# EAGLE design laztech (EAGLE 7.5.0)
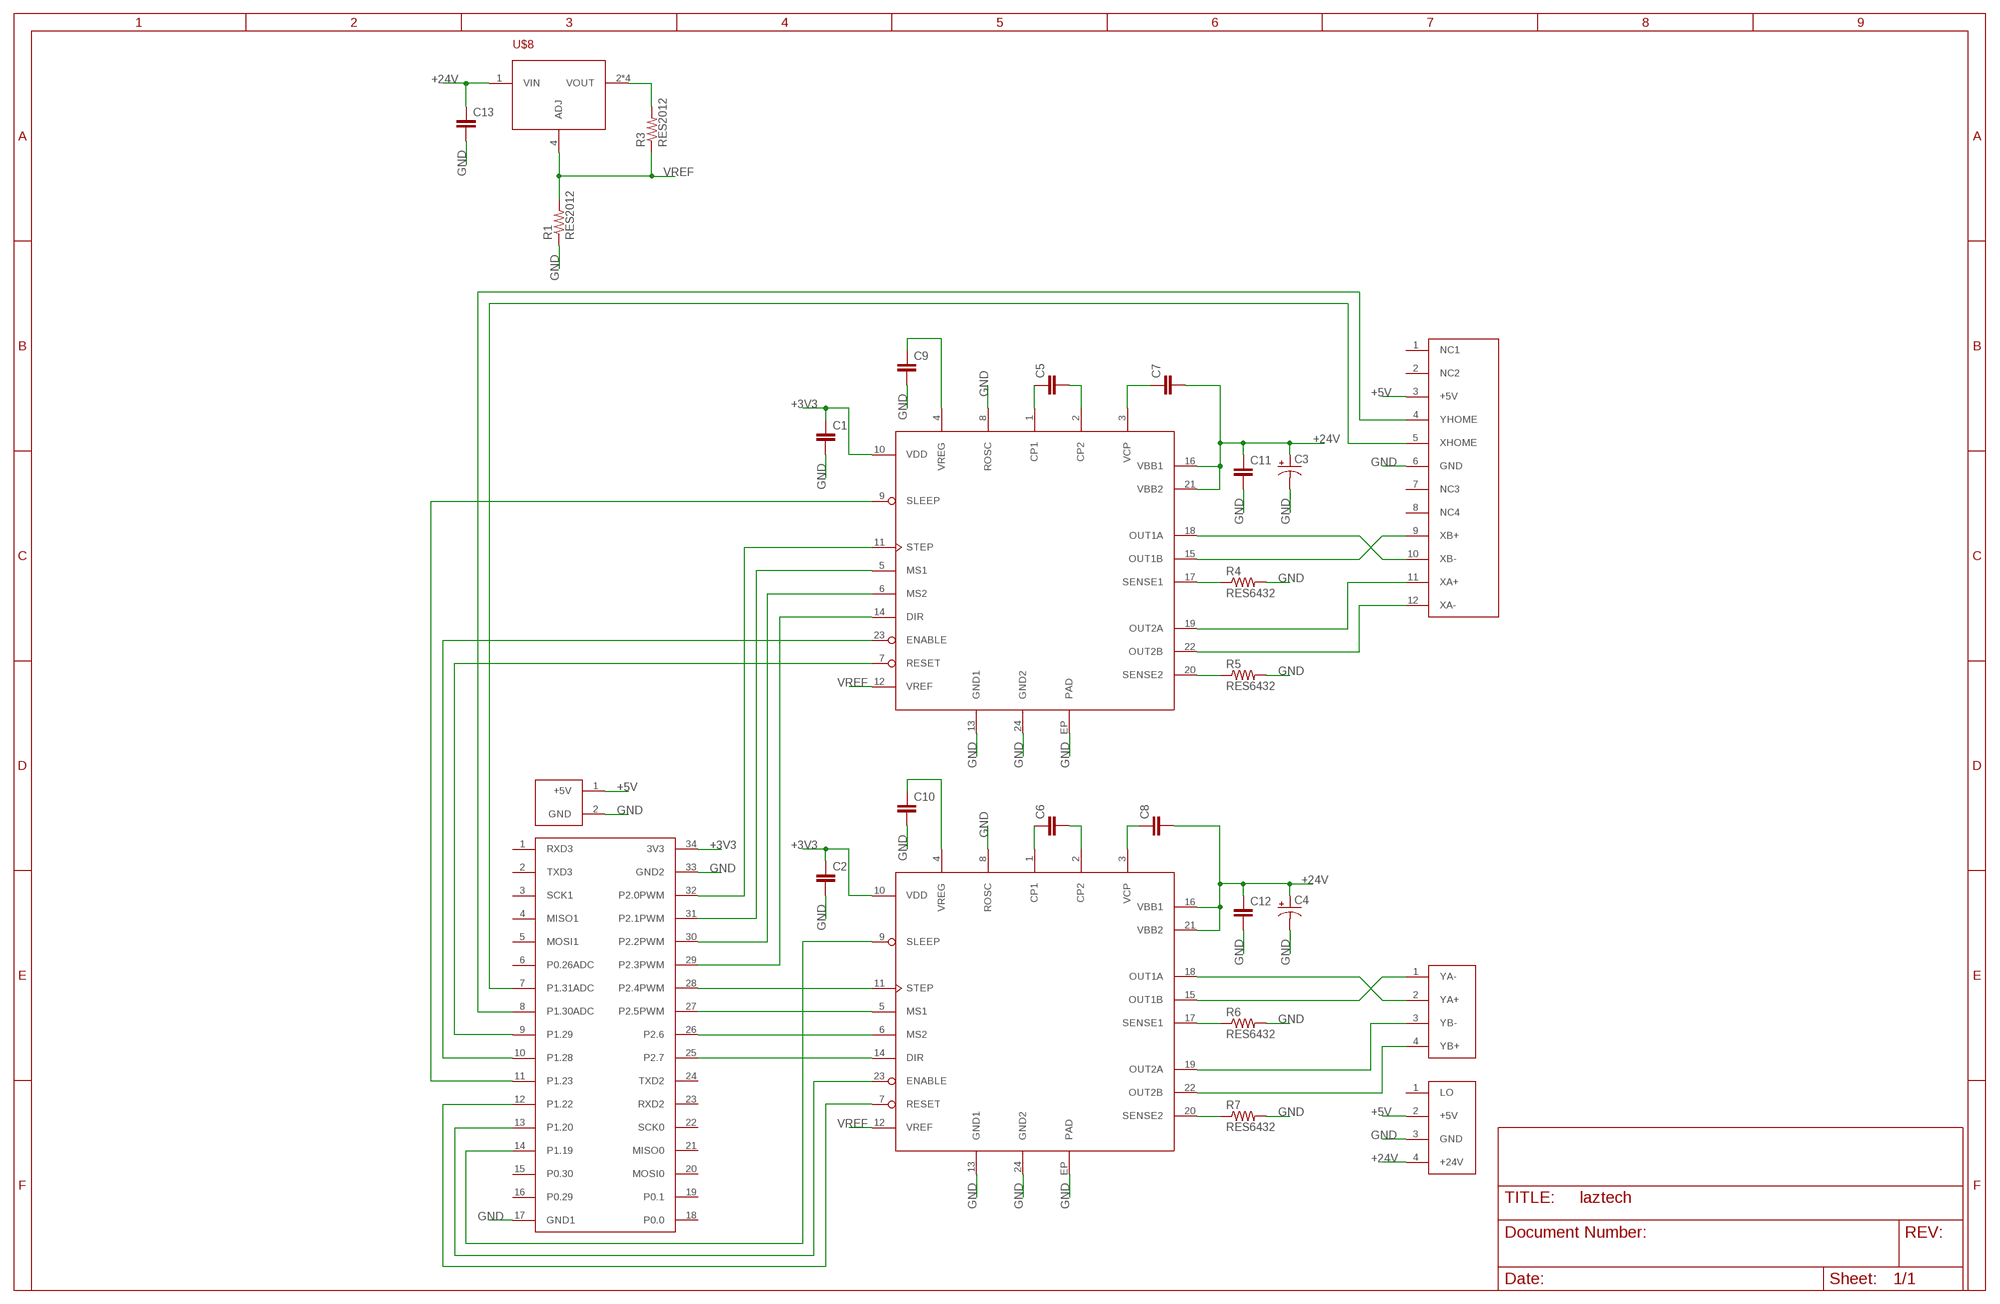
[diagram p0: schematic, sheet 1]

## Parts
C1  CAP  [C2012]
C2  CAP  [C2012]
C3  PCAP  [C6358R]
C4  PCAP  [C6358R]
C5  CAP  [C2012]
C6  CAP  [C2012]
C7  CAP  [C2012]
C8  CAP  [C2012]
C9  CAP  [C2012]
C10  CAP  [C2012]
C11  CAP  [C2012]
C12  CAP  [C2012]
C13  CAP  [C2012]
R1  RES2012  [R2012]
R3  RES2012  [R2012]
R4  RES6432  [R6432]
R5  RES6432  [R6432]
R6  RES6432  [R6432]
R7  RES6432  [R6432]
U$1  A4985SLPTR-T  [ETSSOP-24]
U$2  A4985SLPTR-T  [ETSSOP-24]
U$3  SJSUONEX  [2X17]
U$4  K40-PWR  [MOLEX-KK396-4-RA]
U$5  K40-X  [MOLEX-FFC-12-RA]
U$6  K40-Y  [JST-XH-4_RA]
U$7  SJSUONEVIN  [1X02]
U$8  LM317  [SOIC-8]

## Nets
+3V3: C1.1 C2.1 U$1.10(VDD) U$2.10(VDD) U$3.34(3V3)
+5V: U$4.2(+5V) U$5.3(+5V) U$7.1(+5V)
+24V: C3.2(+) C4.2(+) C7.2 C8.2 C11.1 C12.1 C13.1 U$1.16(VBB1) U$1.21(VBB2) U$2.16(VBB1) U$2.21(VBB2) U$4.4(+24V) U$8.1(VIN)
GND: C1.2 C2.2 C3.1(-) C4.1(-) C9.2 C10.2 C11.2 C12.2 C13.2 R1.1 R4.2 R5.2 R6.2 R7.2 U$1.8(ROSC) U$1.13(GND1) U$1.24(GND2) U$1.EP(PAD) U$2.8(ROSC) U$2.13(GND1) U$2.24(GND2) U$2.EP(PAD) U$3.17(GND1) U$3.33(GND2) U$4.3(GND) U$5.6(GND) U$7.2(GND)
N$1: U$1.18(OUT1A) U$5.10(XB-)
N$2: U$1.15(OUT1B) U$5.9(XB+)
N$3: U$1.19(OUT2A) U$5.11(XA+)
N$4: U$1.22(OUT2B) U$5.12(XA-)
N$5: U$2.15(OUT1B) U$6.1(YA-)
N$6: U$2.18(OUT1A) U$6.2(YA+)
N$7: U$2.19(OUT2A) U$6.3(YB-)
N$8: U$2.22(OUT2B) U$6.4(YB+)
N$9: R4.1 U$1.17(SENSE1)
N$10: U$3.7(P1.31ADC) U$5.5(XHOME)
N$11: U$3.8(P1.30ADC) U$5.4(YHOME)
N$12: U$2.14(DIR) U$3.25(P2.7)
N$13: U$2.6(MS2) U$3.26(P2.6)
N$14: U$2.5(MS1) U$3.27(P2.5PWM)
N$15: U$2.11(STEP) U$3.28(P2.4PWM)
N$16: U$1.11(STEP) U$3.32(P2.0PWM)
N$17: U$1.5(MS1) U$3.31(P2.1PWM)
N$18: U$1.6(MS2) U$3.30(P2.2PWM)
N$19: U$1.14(DIR) U$3.29(P2.3PWM)
N$20: U$2.23(ENABLE) U$3.13(P1.20)
N$21: U$2.7(RESET) U$3.12(P1.22)
N$22: U$2.9(SLEEP) U$3.14(P1.19)
N$23: U$1.7(RESET) U$3.9(P1.29)
N$24: U$1.23(ENABLE) U$3.10(P1.28)
N$25: U$1.9(SLEEP) U$3.11(P1.23)
N$26: C10.1 U$2.4(VREG)
N$27: C6.1 U$2.1(CP1)
N$28: C6.2 U$2.2(CP2)
N$29: C8.1 U$2.3(VCP)
N$30: C9.1 U$1.4(VREG)
N$31: C5.1 U$1.1(CP1)
N$32: C5.2 U$1.2(CP2)
N$33: C7.1 U$1.3(VCP)
N$34: R3.2 U$8.2(VOUT) U$8.3(VOUT) U$8.6(VOUT) U$8.7(VOUT)
N$35: R5.1 U$1.20(SENSE2)
N$38: R6.1 U$2.17(SENSE1)
N$40: R7.1 U$2.20(SENSE2)
VREF: R1.2 R3.1 U$1.12(VREF) U$2.12(VREF) U$8.4(ADJ)
Unconnected: U$3.1(RXD3) U$3.2(TXD3) U$3.3(SCK1) U$3.4(MISO1) U$3.5(MOSI1) U$3.6(P0.26ADC) U$3.15(P0.30) U$3.16(P0.29) U$3.18(P0.0) U$3.19(P0.1) U$3.20(MOSI0) U$3.21(MISO0) U$3.22(SCK0) U$3.23(RXD2) U$3.24(TXD2) U$4.1(LO) U$5.1(NC1) U$5.2(NC2) U$5.7(NC3) U$5.8(NC4)

## Library data of the parts
C1 C2 C5-C13 = laztech_parts:CAP
C3 C4 = laztech_parts:PCAP
R1 R3-R7 = laztech_parts:RES
U$1 U$2 = laztech_parts:A4985SLPTR-T
U$3 = laztech_parts:SJSUONEX
U$4 = laztech_parts:K40-PWR
U$5 = laztech_parts:K40-X
U$6 = laztech_parts:K40-Y
U$7 = laztech_parts:SJSUONEVIN
U$8 = laztech_parts:LM317

## Board
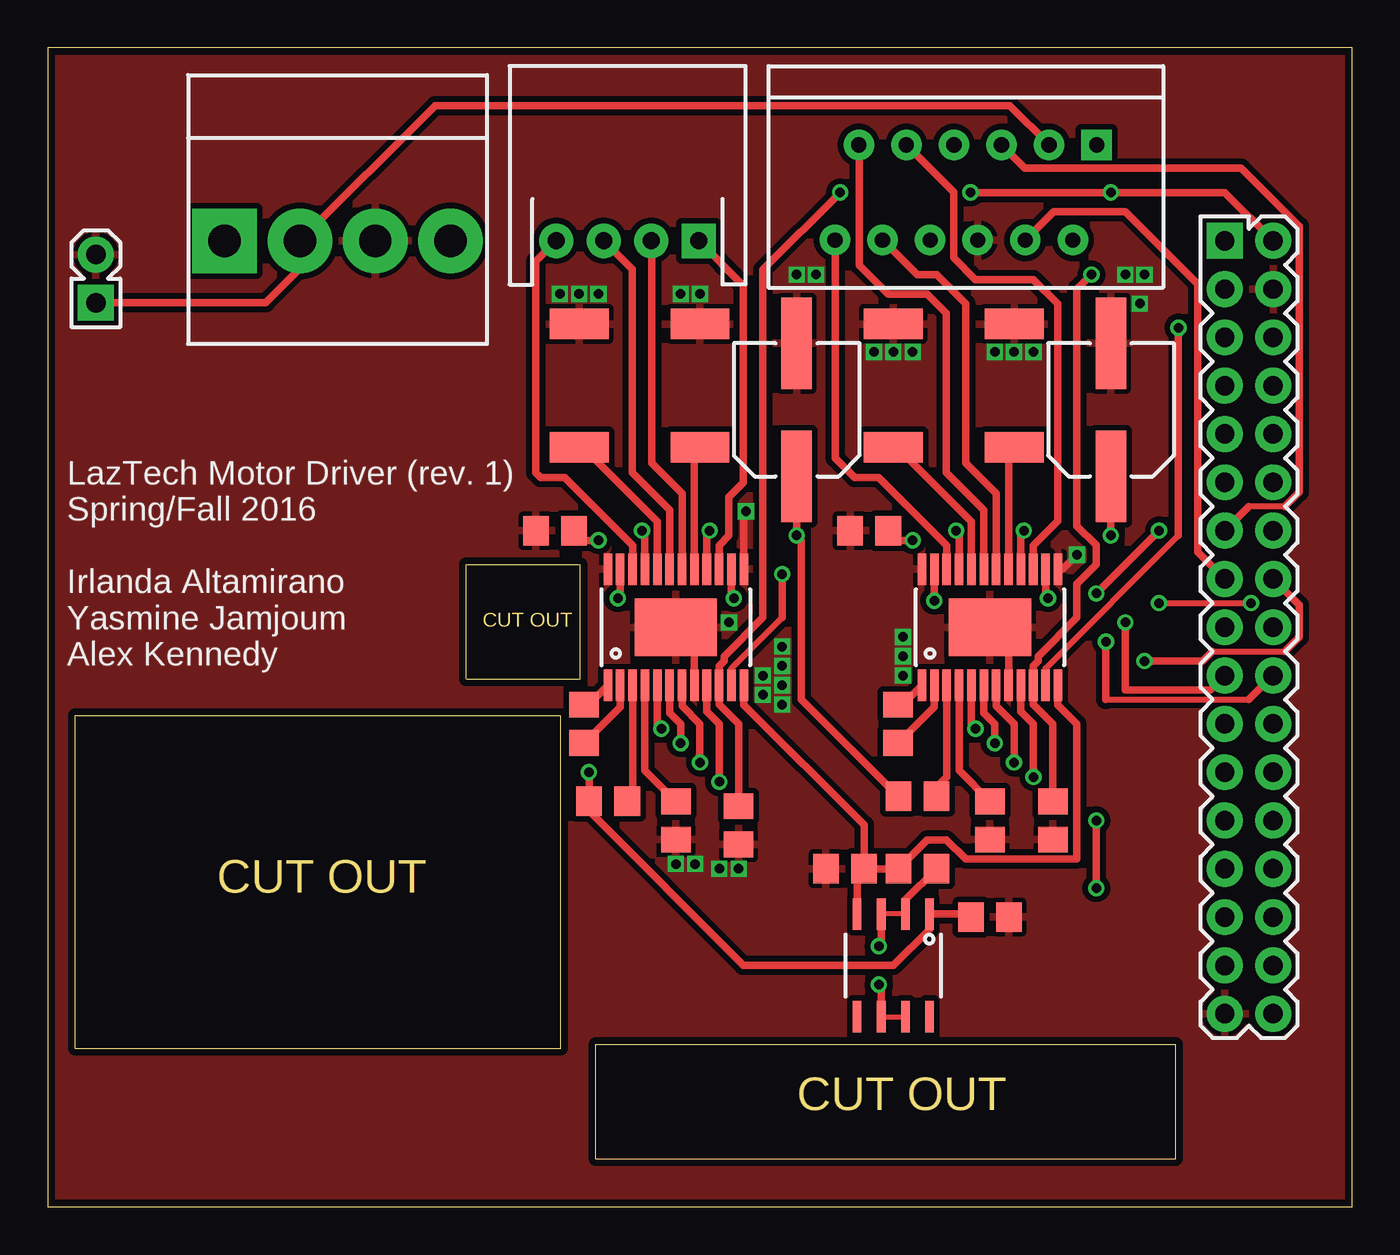
[diagram p1: board, top side]
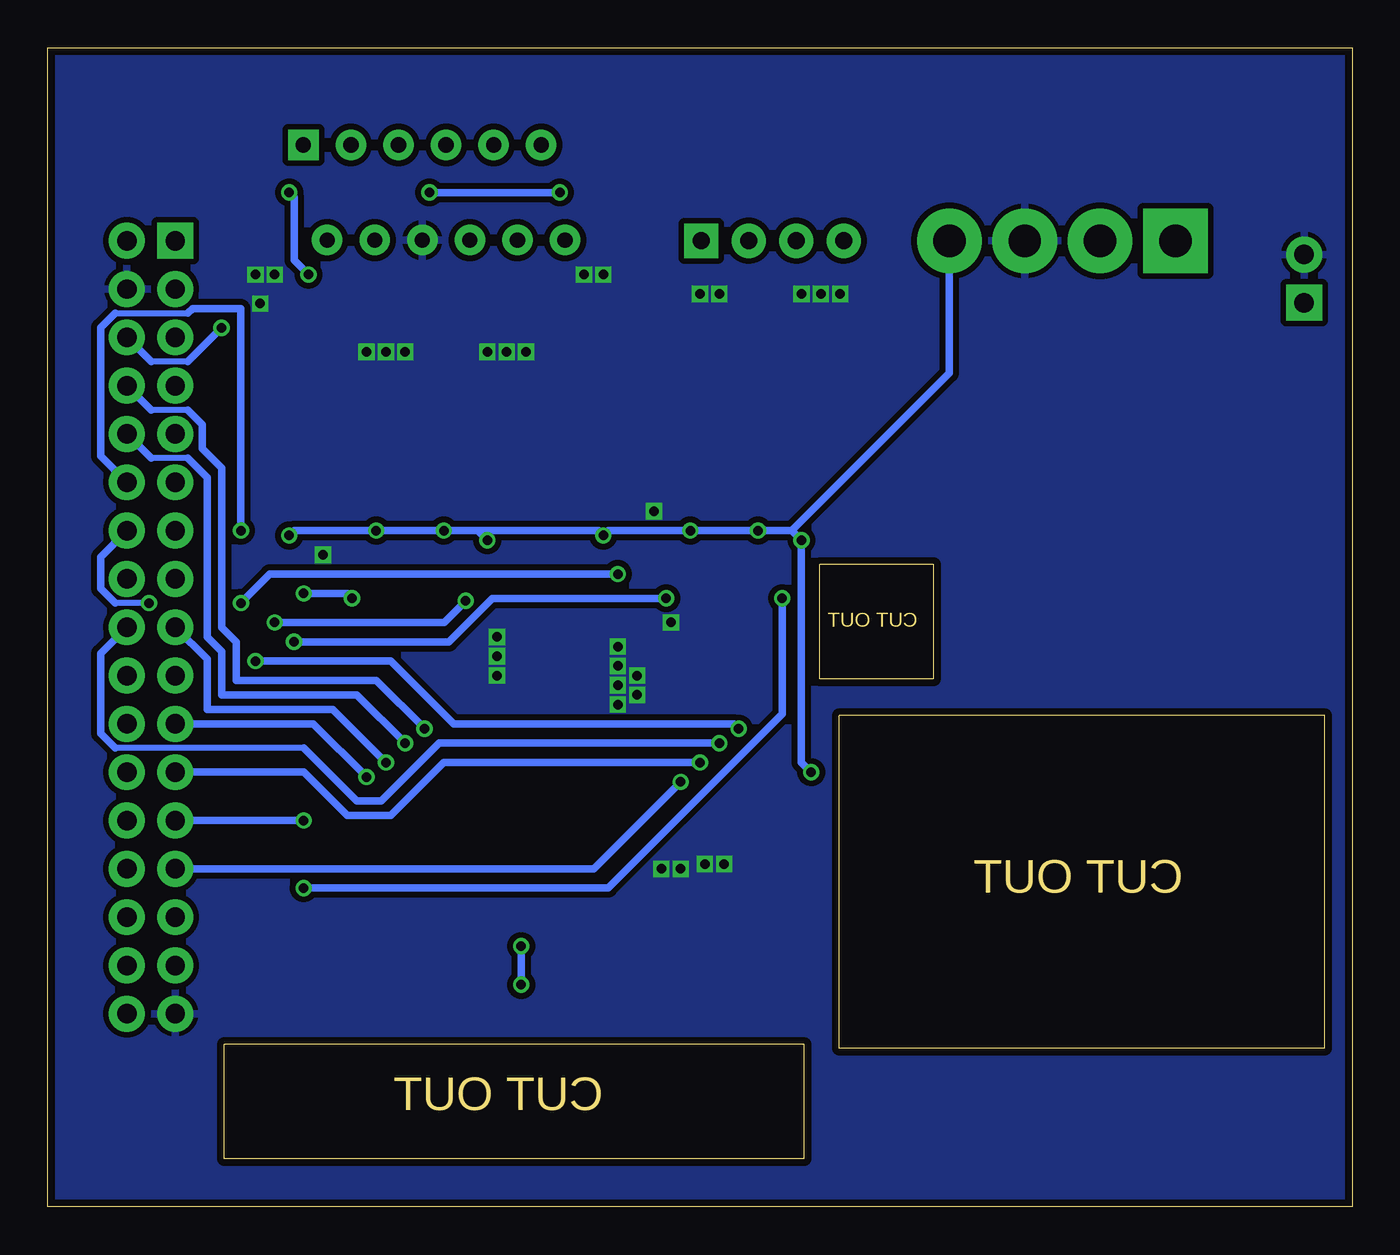
[diagram p2: board, bottom side, seen from below]

Size 68.58 x 60.96 mm. Coordinates in mm from the lower left corner, seen from the top.
Outline: 0,0 68.58,0 68.58,60.96 0,60.96 0,0
Outline: 22,27.77 22,33.77 28,33.77 28,27.77 22,27.77
Outline: 1.46,8.34 1.46,25.84 26.96,25.84 26.96,8.34 1.46,8.34
Outline: 28.8,2.54 28.8,8.54 59.3,8.54 59.3,2.54 28.8,2.54
Copper layers (1*16): Top 0.0356mm / dielectric 1.5011mm / Bottom 0.0356mm
Design rules "LaenPCBOrder": minimum track width 6mil, minimum drill 13mil, track to track 6mil, track to pad 6mil, pad to pad 6mil, via to via 6mil, smd to smd 6mil, copper to edge 15mil, drill to drill 6mil, minimum pad ring 7mil, minimum via ring 7mil, stop-mask expansion 3mil, vias tented up to drill 0mil, thermal gap 10mil

### Footprints (pad centres in the part's own frame; a part is rotated, then mirrored left to right if it is on the bottom)
C2012 = smd 1.35 x 1.55: 1 -1,0; 2 1,0
C6358R = smd 4.8 x 1.6: 1 -3.5,0; 2 3.5,0
R2012 = smd 1.35 x 1.55: 1 -1,0; 2 1,0
R6432 = smd 1.6 x 3.1: 1 -3.25,0; 2 3.25,0
ETSSOP-24 = smd 0.45 x 1.65: 1 -3.575,-3.05; 2 -2.925,-3.05; 3 -2.275,-3.05; 4 -1.625,-3.05; 5 -0.975,-3.05; 6 -0.325,-3.05; 7 0.325,-3.05; 8 0.975,-3.05; 9 1.625,-3.05; 10 2.275,-3.05; 11 2.925,-3.05; 12 3.575,-3.05; 13 3.575,3.05; 14 2.925,3.05; 15 2.275,3.05; 16 1.625,3.05; 17 0.975,3.05; 18 0.325,3.05; 19 -0.325,3.05; 20 -0.975,3.05; 21 -1.625,3.05; 22 -2.275,3.05; 23 -2.925,3.05; 24 -3.575,3.05 | smd 4.32 x 3: EP 0,0
2X17 = drill 1.02 pad 1.887 square: 1 -20.32,-1.27 | drill 1.02 pad 1.887: 2 -17.78,-1.27; 3 -15.24,-1.27; 4 -12.7,-1.27; 5 -10.16,-1.27; 6 -7.62,-1.27; 7 -5.08,-1.27; 8 -2.54,-1.27; 9 0,-1.27; 10 2.54,-1.27; 11 5.08,-1.27; 12 7.62,-1.27; 13 10.16,-1.27; 14 12.7,-1.27; 15 15.24,-1.27; 16 17.78,-1.27; 17 20.32,-1.27; 18 20.32,1.27; 19 17.78,1.27; 20 15.24,1.27; 21 12.7,1.27; 22 10.16,1.27; 23 7.62,1.27; 24 5.08,1.27; 25 2.54,1.27; 26 0,1.27; 27 -2.54,1.27; 28 -5.08,1.27; 29 -7.62,1.27; 30 -10.16,1.27; 31 -12.7,1.27; 32 -15.24,1.27; 33 -17.78,1.27; 34 -20.32,1.27
MOLEX-KK396-4-RA = drill 1.7 pad 3.4 square: 1 -5.94,0 | drill 1.7 pad 3.4: 2 -1.98,0; 3 1.98,0; 4 5.94,0
MOLEX-FFC-12-RA = drill 0.8 pad 1.6 square: 1 6.875,2.5 | drill 0.8 pad 1.6: 2 5.625,-2.5; 3 4.375,2.5; 4 3.125,-2.5; 5 1.875,2.5; 6 0.625,-2.5; 7 -0.625,2.5; 8 -1.875,-2.5; 9 -3.125,2.5; 10 -4.375,-2.5; 11 -5.625,2.5; 12 -6.875,-2.5
JST-XH-4_RA = drill 0.9 pad 1.8 square: 1 3.75,0 | drill 0.9 pad 1.8: 2 1.25,0; 3 -1.25,0; 4 -3.75,0
1X02 = drill 1.02 pad 1.887 square: 1 -1.27,0 | drill 1.02 pad 1.887: 2 1.27,0
SOIC-8 = smd 0.45 x 1.65: 1 -1.905,-2.7; 2 -0.635,-2.7; 3 0.635,-2.7; 4 1.905,-2.7; 5 1.905,2.7; 6 0.635,2.7; 7 -0.635,2.7; 8 -1.905,2.7

### Placement (x,y rotation side)
C1  52.83,20.32 270 top
C2  36.32,20.07 270 top
C3  55.88,41.91 270 top
C4  39.37,41.91 270 top
C5  44.7,25.4 270 top
C6  28.19,25.4 270 top
C7  45.72,21.59 180 top
C8  29.46,21.34 180 top
C9  49.53,20.32 270 top
C10  33.02,20.32 270 top
C11  43.18,35.56 180 top
C12  26.67,35.56 180 top
C13  49.53,15.24 0 top
R1  41.91,17.78 0 top
R3  45.72,17.78 0 top
R4  50.8,43.18 90 top
R5  44.45,43.18 90 top
R6  34.29,43.18 90 top
R7  27.94,43.18 90 top
U$1  49.53,30.48 0 top
U$2  33.02,30.48 0 top
U$3  63.14,30.48 270 top
U$4  15.24,50.8 0 top
U$5  48.26,53.34 0 top
U$6  30.48,50.8 0 top
U$7  2.54,48.81 90 top
U$8  44.45,12.7 180 top

### Tracks (layer width: path | path; a pad name or v marks a point on that pad's centre or on a via)
+3V3  (via drill 0.5 pad 0.25)
  Top 0.406: U$2.10 35.3,26.43 35.31,26.42 | C2.1 36.32,25.4 35.31,26.42 | C1.1 52.83,25.4 51.8,26.43 U$1.10 51.8,28.44 52.07,28.7 52.07,28.96 54.1,30.99 54.1,32.77 55.12,33.78 55.12,34.8 54.1,35.81 54.1,48.26 v54.86,49.02 | 35.31,26.42 35.31,28.45 35.56,28.7 35.56,28.96 37.59,30.99 37.59,49.28 v41.66,53.34 | v48.51,53.34 v55.88,53.34 61.87,53.34 U$3.34
  Bottom 0.406: v41.66,53.34 v48.51,53.34 | v54.86,49.02 55.63,49.78 55.63,53.09 v55.88,53.34
+5V
  Top 0.406: U$5.3 50.56,57.91 20.37,57.91 U$4.2 13.26,49.33 11.47,47.54 U$7.1
+24V  (via drill 0.5 pad 0.25)
  Top 0.406: U$2.21 31.39,35.41 v31.24,35.56 | v28.96,35.05 28.18,35.05 C12.1 | U$1.21 47.91,35.41 v47.75,35.56 | v45.47,35.05 44.69,35.05 C11.1 | C4.2 v39.37,35.31 39.62,35.05 39.62,26.69 C7.2 | C3.2 v55.88,35.31 | U$2.16 34.65,35.41 v34.8,35.56 | U$1.16 51.16,35.41 v51.31,35.56 | C13.1 48.37,15.4 U$8.1 46.35,14.61 44.45,12.7 36.58,12.7 28.46,20.81 C8.2 28.46,22.88 v28.45,22.86
  Bottom 0.406: 29.46,35.56 v31.24,35.56 v34.8,35.56 39.12,35.56 v39.37,35.31 39.62,35.56 45.97,35.56 | 29.46,35.56 v28.96,35.05 28.96,23.37 v28.45,22.86 | 45.97,35.56 v47.75,35.56 v51.31,35.56 55.63,35.56 v55.88,35.31 | 45.97,35.56 v45.47,35.05 | U$4.4 21.18,43.84 29.46,35.56
GND  (via drill 0.5)
  Top 0.254: 33.99,29.5 U$2.EP | 50.51,29.5 U$1.EP
  Top 0.406: U$2.8 33.99,29.5 | U$1.8 50.51,29.5 | U$1.13 53.34,33.53 v54.1,34.29 | U$2.13 36.59,36.34 v36.7,36.58
  other vias: 27.94,48.01 28.96,48.01 26.92,48.01 34.29,48.01 33.27,48.01 44.45,44.96 45.47,44.96 43.43,44.96 50.8,44.96 49.78,44.96 51.82,44.96 39.37,49.02 40.39,49.02 56.64,49.02 57.66,49.02 57.4,47.5 35.81,30.73 38.61,26.42 38.61,27.43 38.61,28.45 38.61,29.46 37.59,26.92 37.59,27.94 36.32,17.78 35.31,17.78 33.02,18.03 34.04,18.03 44.96,27.94 44.96,28.96 44.96,29.97
  pour Bottom (isolate 0.305): -1.27,-1.27 -1.27,62.23 69.85,62.23 69.85,-1.27
  pour Top (isolate 0.305): -2.54,-2.54 -2.54,63.5 71.12,63.5 71.12,-2.54
N$1
  Top 0.406: U$1.18 49.85,37.52 48.26,39.12 48.26,47.5 46.74,49.02 45.7,49.02 U$5.10
N$2
  Top 0.406: U$1.15 51.8,34.79 53.09,36.07 53.09,47.5 51.82,48.77 48.77,48.77 47.62,49.91 47.62,53.35 U$5.9
N$3
  Top 0.406: U$1.19 49.2,36.65 47.24,38.61 47.24,46.99 46.23,48.01 44.2,48.01 42.67,49.53 42.67,55.8 U$5.11
N$4
  Top 0.406: U$1.22 47.26,34.79 43.69,38.35 42.42,38.35 41.4,39.37 41.4,50.82 U$5.12
N$5
  Top 0.406: U$2.15 35.3,34.79 35.81,35.31 35.81,37.34 36.58,38.1 36.58,48.45 U$6.1
N$6
  Top 0.406: U$2.18 33.34,37.52 31.75,39.12 31.75,50.78 U$6.2
N$7
  Top 0.406: U$2.19 32.7,36.65 30.73,38.61 30.73,49.3 U$6.3
N$8
  Top 0.406: U$2.22 30.75,34.79 27.18,38.35 25.91,38.35 25.65,38.61 25.65,49.72 U$6.4
N$9
  Top 0.406: U$1.17 50.51,39.63 R4.1
N$10
  Top 0.305: 65.02,36.83 63.14,36.83
  Top 0.406: U$5.5 51.37,54.61 62.74,54.61 65.79,51.56 65.79,37.59 65.02,36.83 | 63.14,36.83 U$3.7
N$11
  Top 0.406: U$3.8 60.45,34.44 60.45,48.51 56.64,52.32 52.87,52.32 U$5.4
N$12  (via drill 0.5 pad 0.25)
  Top 0.305: 55.63,26.67 63.14,26.67
  Top 0.406: U$2.14 35.95,32.13 v36.07,32 | v55.63,29.72 55.63,26.67 | 63.14,26.67 U$3.25
  Bottom 0.406: v36.07,32 45.21,32 47.5,29.72 v55.63,29.72
N$13  (via drill 0.5 pad 0.25)
  Top 0.406: U$2.6 32.7,25.98 33.27,25.4 v33.27,24.38
  Bottom 0.305: 55.12,24.13 65.02,24.13
  Bottom 0.406: v33.27,24.38 48.01,24.38 51.05,21.34 52.32,21.34 55.12,24.13 | 65.02,24.13 65.79,24.89 65.79,29.1 U$3.26
N$14  (via drill 0.5 pad 0.25)
  Top 0.305: 61.21,29.21 65.02,29.21
  Top 0.406: U$2.5 32.05,25.36 v32.26,25.15 | 61.21,29.21 60.71,28.7 v57.66,28.7 | 65.02,29.21 65.79,29.97 65.79,31.64 U$3.27
  Bottom 0.406: v32.26,25.15 32.51,25.4 47.24,25.4 50.55,28.7 v57.66,28.7
N$15  (via drill 0.5 pad 0.25)
  Top 0.305: U$2.11 35.95,28.32 38.61,30.99 | v58.42,31.75 v63.25,31.75
  Top 0.406: 38.61,30.99 v38.61,33.27
  Bottom 0.305: v63.25,31.75 65.02,31.75
  Bottom 0.406: v38.61,33.27 56.9,33.27 v58.42,31.75 | 65.02,31.75 65.79,32.51 65.79,34.18 U$3.28
N$16  (via drill 0.5 pad 0.25)
  Top 0.305: U$1.11 52.45,28.32 59.44,35.31
  Top 0.406: 59.44,35.31 v59.44,46.23
  Bottom 0.305: 61.21,44.45 63.14,44.45
  Bottom 0.406: v59.44,46.23 61.21,44.45 | 63.14,44.45 U$3.32
N$17  (via drill 0.5 pad 0.25)
  Top 0.406: U$1.5 48.55,25.36 v48.77,25.15
  Bottom 0.305: 61.21,41.91 63.14,41.91
  Bottom 0.406: v48.77,25.15 51.31,27.69 58.67,27.69 58.67,29.72 59.44,30.48 59.44,38.86 60.45,39.88 60.45,41.15 61.21,41.91 | 63.14,41.91 U$3.31
N$18  (via drill 0.5 pad 0.25)
  Top 0.406: U$1.6 49.2,25.98 49.78,25.4 v49.78,24.38
  Bottom 0.305: 61.21,39.37 63.14,39.37
  Bottom 0.406: v49.78,24.38 52.32,26.92 59.44,26.92 59.44,29.21 60.2,29.97 60.2,38.35 61.21,39.37 | 63.14,39.37 U$3.30
N$19  (via drill 0.5 pad 0.25)
  Top 0.406: v58.42,35.56 v55.12,32.26 | v52.58,32 52.45,32.13 U$1.14
  Bottom 0.305: 65.02,46.99 61.21,46.99
  Bottom 0.406: U$3.29 65.79,39.48 65.79,46.23 65.02,46.99 | 61.21,46.99 60.96,47.24 58.42,47.24 v58.42,35.56 | v55.12,32.26 52.83,32.26 v52.58,32
N$20  (via drill 0.5 pad 0.25)
  Top 0.406: v55.12,20.32 v55.12,16.76 | v29.97,32 30.09,32.13 U$2.23
  Bottom 0.406: U$3.13 v55.12,20.32 | v55.12,16.76 39.12,16.76 29.97,25.91 v29.97,32
N$21  (via drill 0.5 pad 0.25)
  Top 0.406: U$2.7 33.34,26.34 34.29,25.4 v34.29,23.37
  Bottom 0.406: v34.29,23.37 47.75,23.37 50.55,20.57 52.83,20.57 55.12,22.86 U$3.12
N$22  (via drill 0.5 pad 0.25)
  Top 0.406: U$2.9 34.65,26.06 35.31,25.4 v35.31,22.35
  Bottom 0.406: v35.31,22.35 39.88,17.78 U$3.14
N$23  (via drill 0.5 pad 0.25)
  Top 0.406: U$1.7 49.85,26.34 50.8,25.4 v50.8,23.37
  Bottom 0.406: v50.8,23.37 53.59,26.16 60.2,26.16 60.2,28.81 U$3.9
N$24  (via drill 0.5 pad 0.25)
  Top 0.406: U$1.23 v46.6,31.87 | v56.64,30.73 56.64,27.18 61.11,27.18 U$3.10
  Bottom 0.406: v46.6,31.87 47.74,30.73 v56.64,30.73
N$25  (via drill 0.5 pad 0.25)
  Top 0.406: U$1.9 51.16,26.06 51.82,25.4 v51.82,22.61
  Bottom 0.406: v51.82,22.61 54.61,25.4 U$3.11
N$26
  Top 0.406: U$2.4 31.39,22.95 C10.1
N$27
  Top 0.406: U$2.1 28.41,26.4 C6.1
N$28
  Top 0.406: U$2.2 30.09,26.3 C6.2
N$29
  Top 0.406: U$2.3 30.75,21.6 30.46,21.32 C8.1
N$30
  Top 0.406: U$1.4 47.91,22.95 C9.1
N$31
  Top 0.406: U$1.1 44.92,26.4 C5.1
N$32
  Top 0.406: U$1.2 46.6,26.3 C5.2
N$33
  Top 0.406: U$1.3 47.26,22.62 46.72,22.08 C7.1
N$34  (via drill 0.5 pad 0.25)
  Top 0.254: U$8.2 U$8.3 | U$8.6 U$8.7
  Top 0.406: R3.2 45.09,16.14 U$8.2 | U$8.6 43.81,11.68 v43.69,11.68 | v43.69,13.72 43.81,13.72 U$8.3
  Bottom 0.406: v43.69,11.68 v43.69,13.72
N$35
  Top 0.406: U$1.20 48.55,36.03 44.65,39.93 R5.1
N$38
  Top 0.406: U$2.17 33.99,39.63 R6.1
N$40
  Top 0.406: U$2.20 32.05,36.03 28.14,39.93 R7.1
VREF
  Top 0.406: U$8.4 42.55,17.41 R1.2 | R1.2 R3.1 46.24,19.3 47.24,19.3 48.26,18.29 54.1,18.29 54.1,25.4 53.1,26.4 U$1.12 | U$2.12 36.59,26.4 42.91,20.08 R1.2

### Text on the board
Dimension: CUT OUT | CUT OUT | CUT OUT
tPlace: LazTech Motor Driver (rev. 1) / Spring/Fall 2016 / / Irlanda Altamirano / Yasmine Jamjoum / Alex Kennedy